# EAGLE design valve (EAGLE 9.6.2)
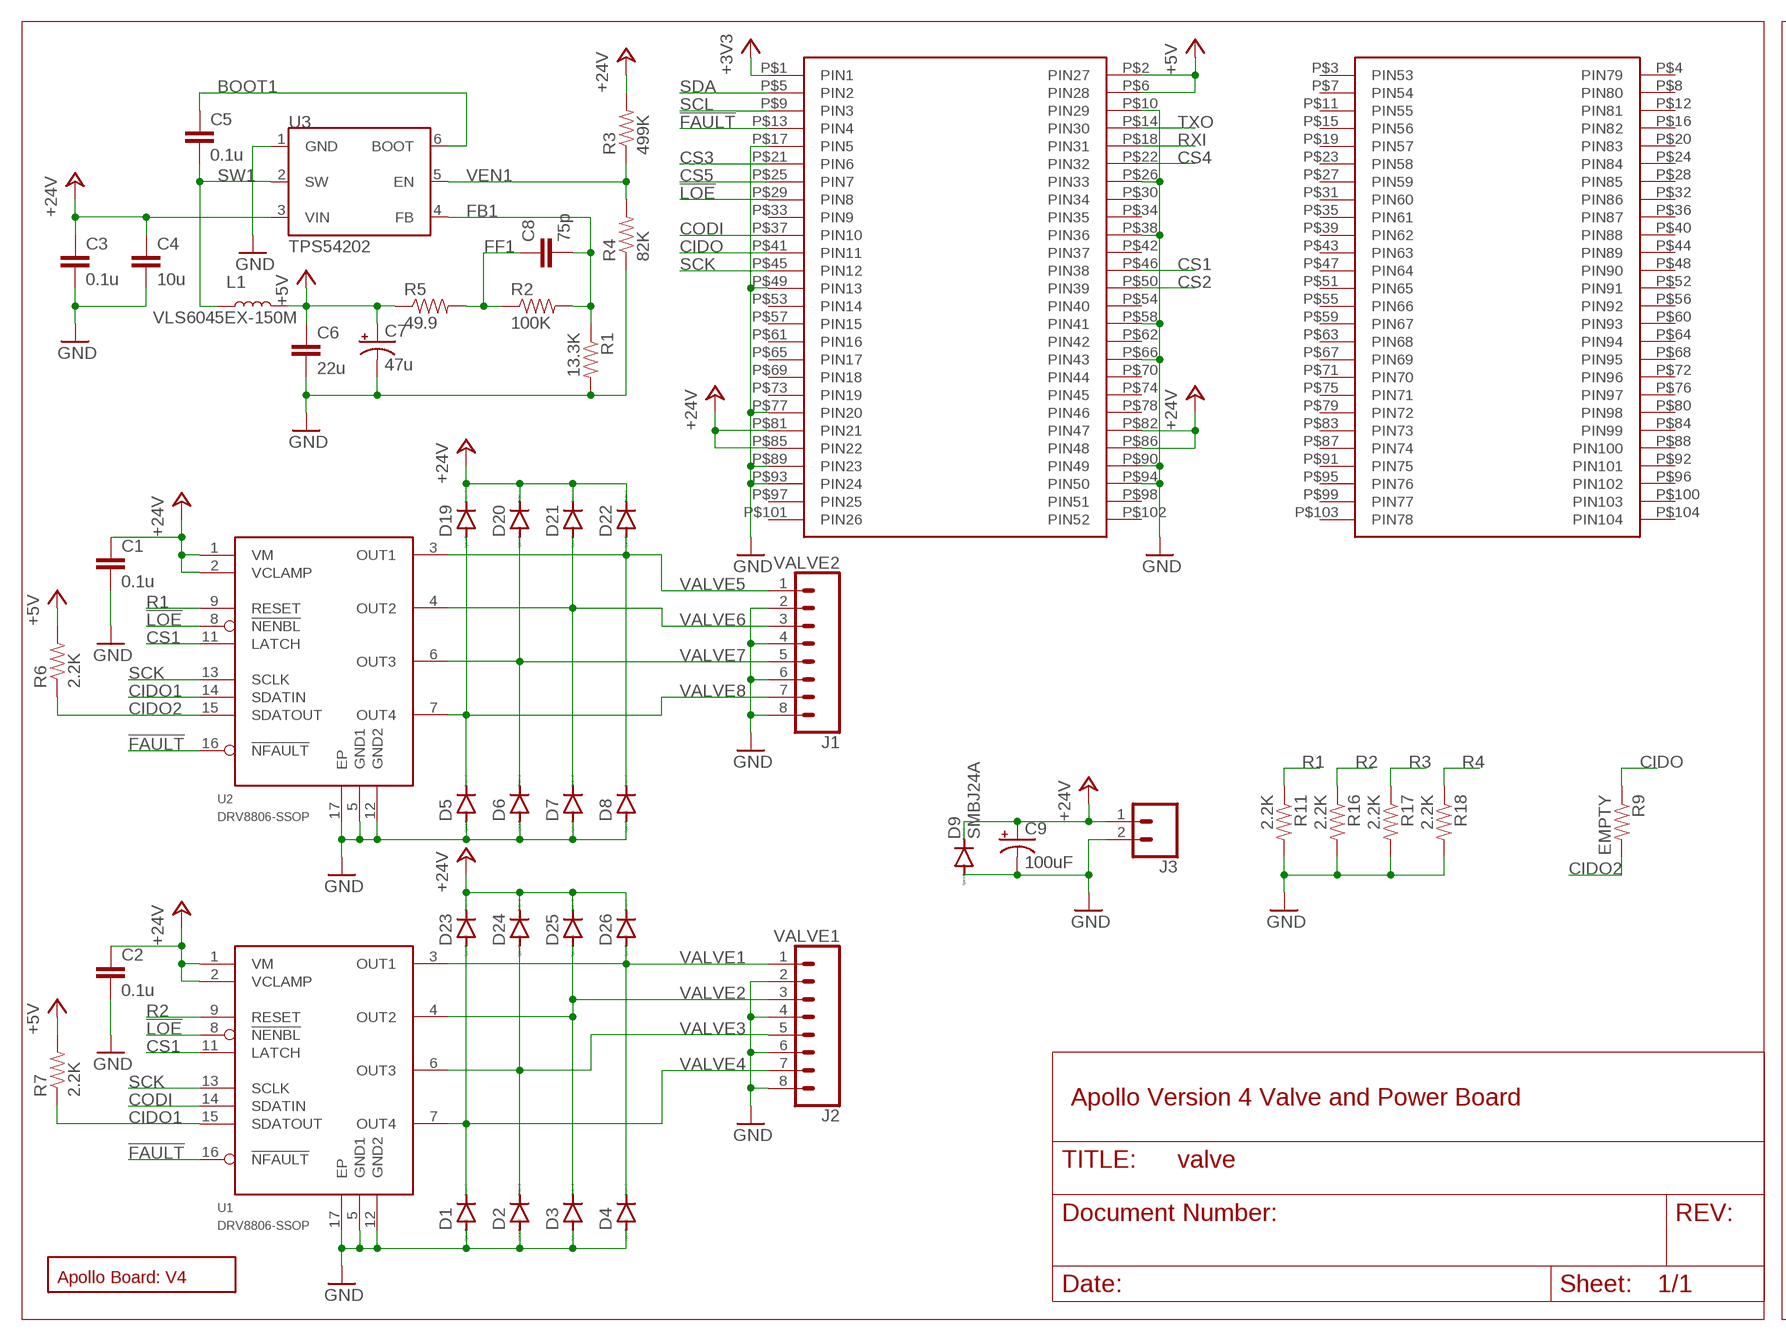
[diagram p0: schematic, sheet 1, part 1 of 2]
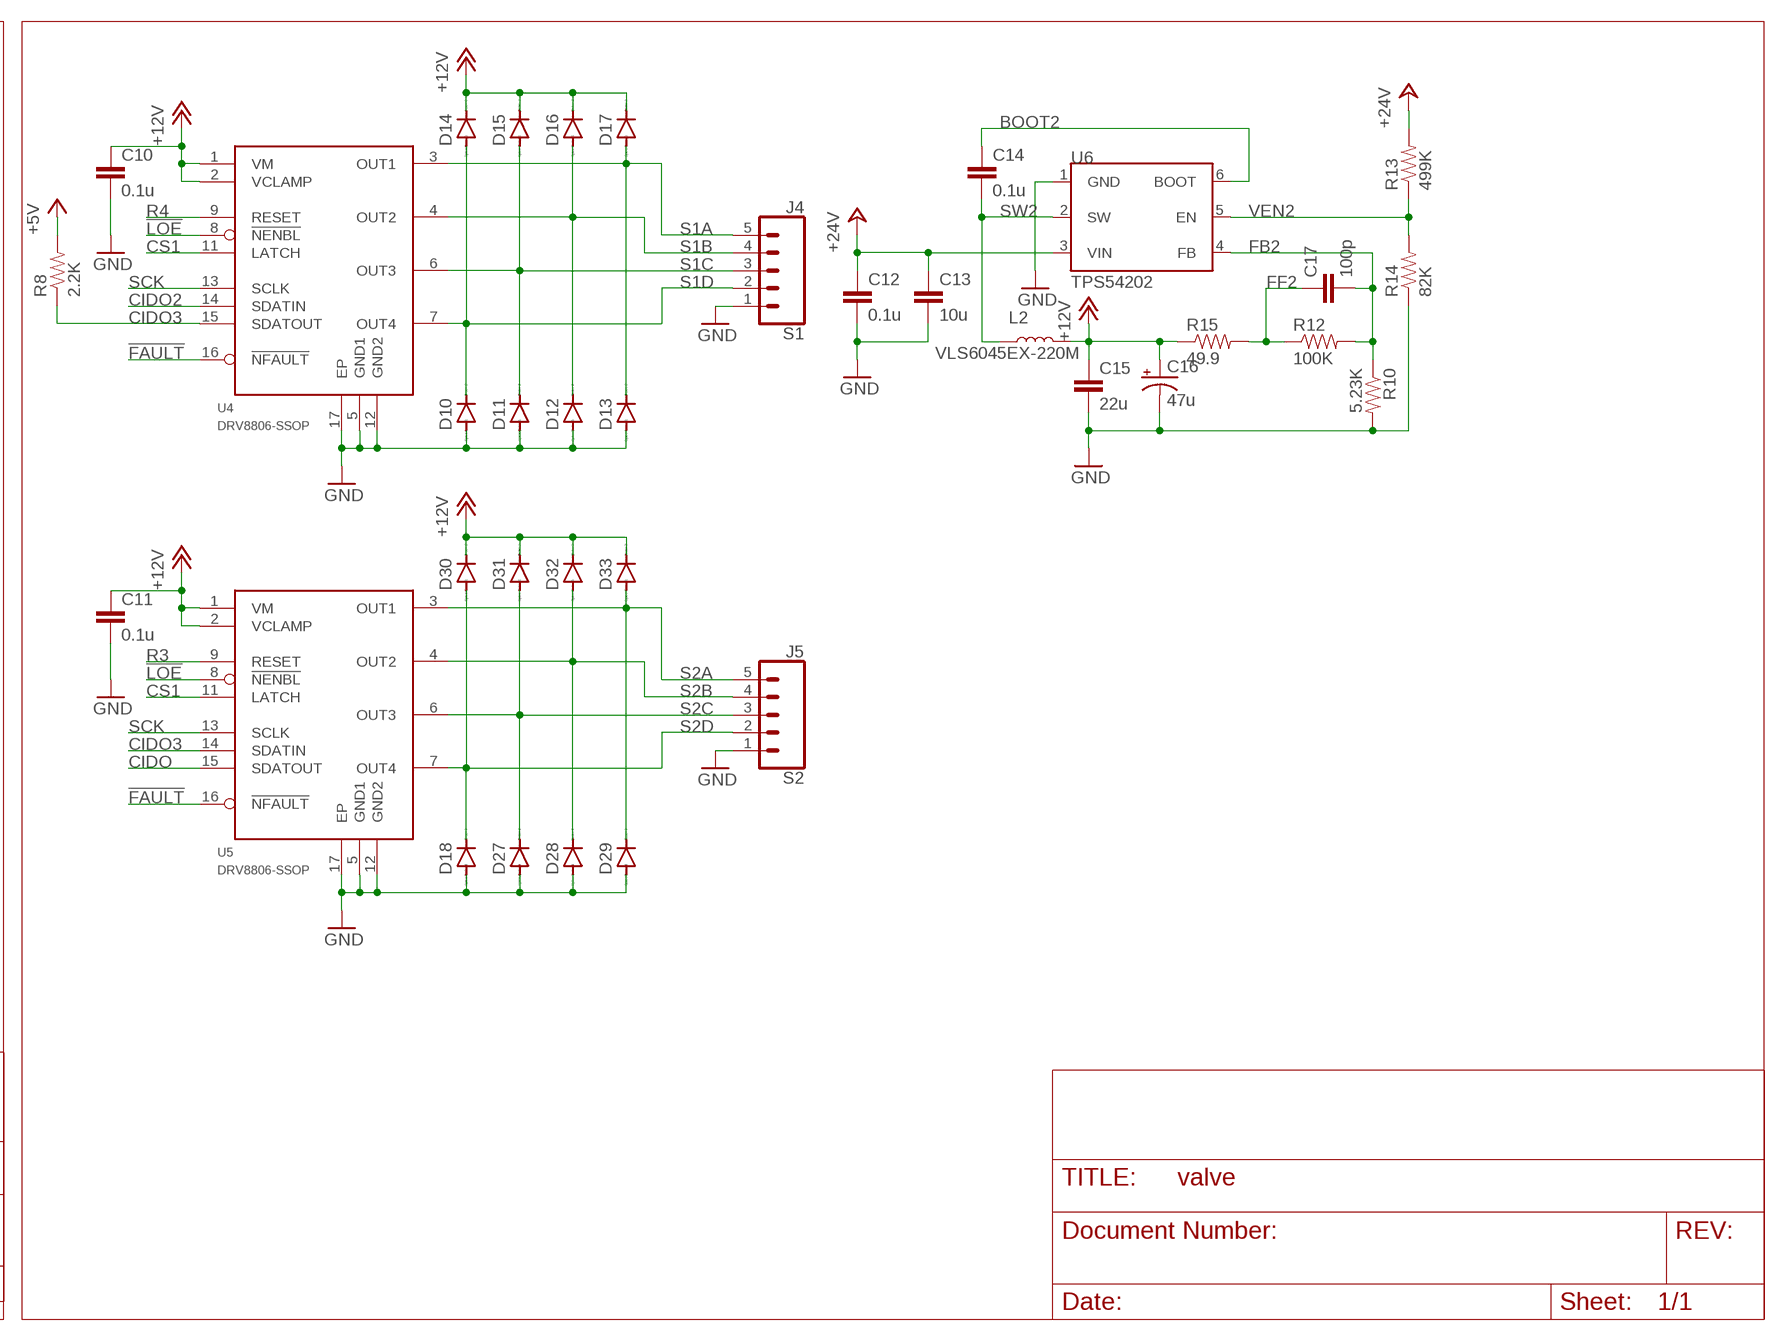
[diagram p1: schematic, sheet 1, part 2 of 2]

## Parts
C1  0.1u  CAP0805  [0805]
C2  0.1u  CAP0805  [0805]
C3  0.1u  CAP0805  [0805]
C4  10u  CAP0805  [0805]
C5  0.1u  CAP0805  [0805]
C6  22u  CAP0805  [0805]
C7  47u  CAP_POLC  [PANASONIC_C]
C8  75p  CAP0805  [0805]
C9  100uF  100UF-POLAR-25V-20%(ELEC)  [PANASONIC_D]
C10  0.1u  CAP0805  [0805]
C11  0.1u  CAP0805  [0805]
C12  0.1u  CAP0805  [0805]
C13  10u  CAP0805  [0805]
C14  0.1u  CAP0805  [0805]
C15  22u  CAP0805  [0805]
C16  47u  CAP_POLC  [PANASONIC_C]
C17  100p  CAP0805  [0805]
D1  B5819W  DIODE-SOD123  [SOD123]
D2  B5819W  DIODE-SOD123  [SOD123]
D3  B5819W  DIODE-SOD123  [SOD123]
D4  B5819W  DIODE-SOD123  [SOD123]
D5  B5819W  DIODE-SOD123  [SOD123]
D6  B5819W  DIODE-SOD123  [SOD123]
D7  B5819W  DIODE-SOD123  [SOD123]
D8  B5819W  DIODE-SOD123  [SOD123]
D9  SMBJ24A  DIODE-SMB  [SMB]
D10  B5819W  DIODE-SOD123  [SOD123]
D11  B5819W  DIODE-SOD123  [SOD123]
D12  B5819W  DIODE-SOD123  [SOD123]
D13  B5819W  DIODE-SOD123  [SOD123]
D14  B5819W  DIODE-SOD123  [SOD123]
D15  B5819W  DIODE-SOD123  [SOD123]
D16  B5819W  DIODE-SOD123  [SOD123]
D17  B5819W  DIODE-SOD123  [SOD123]
D18  B5819W  DIODE-SOD123  [SOD123]
D19  B5819W  DIODE-SOD123  [SOD123]
D20  B5819W  DIODE-SOD123  [SOD123]
D21  B5819W  DIODE-SOD123  [SOD123]
D22  B5819W  DIODE-SOD123  [SOD123]
D23  B5819W  DIODE-SOD123  [SOD123]
D24  B5819W  DIODE-SOD123  [SOD123]
D25  B5819W  DIODE-SOD123  [SOD123]
D26  B5819W  DIODE-SOD123  [SOD123]
D27  B5819W  DIODE-SOD123  [SOD123]
D28  B5819W  DIODE-SOD123  [SOD123]
D29  B5819W  DIODE-SOD123  [SOD123]
D30  B5819W  DIODE-SOD123  [SOD123]
D31  B5819W  DIODE-SOD123  [SOD123]
D32  B5819W  DIODE-SOD123  [SOD123]
D33  B5819W  DIODE-SOD123  [SOD123]
J1  VALVE2  CONN_083.5MM-8  [SCREWTERMINAL-3.5MM-8]
J2  VALVE1  CONN_083.5MM-8  [SCREWTERMINAL-3.5MM-8]
J3  CONN_023.5MM  [SCREWTERMINAL-3.5MM-2]
J4  S1  CONN_05JST  [JST-5-PTH]
J5  S2  CONN_05JST  [JST-5-PTH]
L1  VLS6045EX-150M  VLS6045EX-H  [VLS6045EX]
L2  VLS6045EX-220M  VLS6045EX-H  [VLS6045EX]
R1  13.3K  RESISTOR0805-RES  [0805]
R2  100K  RESISTOR0805-RES  [0805]
R3  499K  RESISTOR0805-RES  [0805]
R4  82K  RESISTOR0805-RES  [0805]
R5  49.9  RESISTOR0805-RES  [0805]
R6  2.2K  RESISTOR0805-RES  [0805]
R7  2.2K  RESISTOR0805-RES  [0805]
R8  2.2K  RESISTOR0805-RES  [0805]
R9  EMPTY  RESISTOR0805-RES  [0805]
R10  5.23K  RESISTOR0805-RES  [0805]
R11  2.2K  RESISTOR0805-RES  [0805]
R12  100K  RESISTOR0805-RES  [0805]
R13  499K  RESISTOR0805-RES  [0805]
R14  82K  RESISTOR0805-RES  [0805]
R15  49.9  RESISTOR0805-RES  [0805]
R16  2.2K  RESISTOR0805-RES  [0805]
R17  2.2K  RESISTOR0805-RES  [0805]
R18  2.2K  RESISTOR0805-RES  [0805]
U1  DRV8806-SSOP  [SOP65P640X120-17N]
U2  DRV8806-SSOP  [SOP65P640X120-17N]
U3  TPS54202  [SOT23-6L]
U4  DRV8806-SSOP  [SOP65P640X120-17N]
U5  DRV8806-SSOP  [SOP65P640X120-17N]
U6  TPS54202  [SOT23-6L]
U$1  PC104_CONNECTOR  [PC104_CONNECTOR]
U$2  BOARD_TEMPLATE1  [BOARD_TEMPLATE]

## Nets
!FAULT!: U1.16(!NFAULT) U2.16(!NFAULT) U4.16(!NFAULT) U5.16(!NFAULT) U$1.P$13(PIN4)
!LOE!: U1.8(!NENBL) U2.8(!NENBL) U4.8(!NENBL) U5.8(!NENBL) U$1.P$29(PIN8)
+3V3: U$1.P$1(PIN1)
+5V: C6.1 C7.+ L1.2 R5.1 R6.2 R7.2 R8.2 U$1.P$2(PIN27) U$1.P$6(PIN28)
+12V: C10.1 C11.1 C15.1 C16.+ D14.C D15.C D16.C D17.C D30.C D31.C D32.C D33.C L2.2 R15.1 U4.1(VM) U4.2(VCLAMP) U5.1(VM) U5.2(VCLAMP)
+24V: C1.1 C2.1 C3.1 C4.1 C9.+ C12.1 C13.1 D9.C D19.C D20.C D21.C D22.C D23.C D24.C D25.C D26.C J3.1 R3.2 R13.2 U1.1(VM) U1.2(VCLAMP) U2.1(VM) U2.2(VCLAMP) U3.3(VIN) U6.3(VIN) U$1.P$81(PIN21) U$1.P$82(PIN47) U$1.P$85(PIN22) U$1.P$86(PIN48)
BOOT1: C5.1 U3.6(BOOT)
BOOT2: C14.1 U6.6(BOOT)
CIDO: R9.1 U5.15(SDATOUT) U$1.P$41(PIN11)
CIDO1: R7.1 U1.15(SDATOUT) U2.14(SDATIN)
CIDO2: R6.1 R9.2 U2.15(SDATOUT) U4.14(SDATIN)
CIDO3: R8.1 U4.15(SDATOUT) U5.14(SDATIN)
CODI: U1.14(SDATIN) U$1.P$37(PIN10)
CS1: U1.11(LATCH) U2.11(LATCH) U4.11(LATCH) U5.11(LATCH) U$1.P$46(PIN38)
CS2: U$1.P$50(PIN39)
CS3: U$1.P$21(PIN6)
CS4: U$1.P$22(PIN32)
CS5: U$1.P$25(PIN7)
FB1: C8.2 R1.1 R2.2 U3.4(FB)
FB2: C17.2 R10.1 R12.2 U6.4(FB)
FF1: C8.1 R2.1 R5.2
FF2: C17.1 R12.1 R15.2
GND: C1.2 C2.2 C3.2 C4.2 C6.2 C7.- C9.- C10.2 C11.2 C12.2 C13.2 C15.2 C16.- D1.A D2.A D3.A D4.A D5.A D6.A D7.A D8.A D9.A D10.A D11.A D12.A D13.A D18.A D27.A D28.A D29.A J1.2 J1.4 J1.6 J1.8 J2.2 J2.4 J2.6 J2.8 J3.2 J4.1 J5.1 R1.2 R4.1 R10.2 R11.2 R14.1 R16.2 R17.2 R18.2 U1.5(GND1) U1.12(GND2) U1.17(EP) U2.5(GND1) U2.12(GND2) U2.17(EP) U3.1(GND) U4.5(GND1) U4.12(GND2) U4.17(EP) U5.5(GND1) U5.12(GND2) U5.17(EP) U6.1(GND) U$1.P$10(PIN29) U$1.P$17(PIN5) U$1.P$26(PIN33) U$1.P$38(PIN36) U$1.P$49(PIN13) U$1.P$58(PIN41) U$1.P$66(PIN43) U$1.P$77(PIN20) U$1.P$89(PIN23) U$1.P$90(PIN49) U$1.P$93(PIN24) U$1.P$94(PIN50)
R1: R11.1 U2.9(RESET)
R2: R16.1 U1.9(RESET)
R3: R17.1 U5.9(RESET)
R4: R18.1 U4.9(RESET)
RXI: U$1.P$18(PIN31)
S1A: D13.C D17.A J4.5 U4.3(OUT1)
S1B: D12.C D16.A J4.4 U4.4(OUT2)
S1C: D11.C D15.A J4.3 U4.6(OUT3)
S1D: D10.C D14.A J4.2 U4.7(OUT4)
S2A: D29.C D33.A J5.5 U5.3(OUT1)
S2B: D28.C D32.A J5.4 U5.4(OUT2)
S2C: D27.C D31.A J5.3 U5.6(OUT3)
S2D: D18.C D30.A J5.2 U5.7(OUT4)
SCK: U1.13(SCLK) U2.13(SCLK) U4.13(SCLK) U5.13(SCLK) U$1.P$45(PIN12)
SCL: U$1.P$9(PIN3)
SDA: U$1.P$5(PIN2)
SW1: C5.2 L1.1 U3.2(SW)
SW2: C14.2 L2.1 U6.2(SW)
TXO: U$1.P$14(PIN30)
VALVE1: D4.C D26.A J2.1 U1.3(OUT1)
VALVE2: D3.C D25.A J2.3 U1.4(OUT2)
VALVE3: D2.C D24.A J2.5 U1.6(OUT3)
VALVE4: D1.C D23.A J2.7 U1.7(OUT4)
VALVE5: D8.C D22.A J1.1 U2.3(OUT1)
VALVE6: D7.C D21.A J1.3 U2.4(OUT2)
VALVE7: D6.C D20.A J1.5 U2.6(OUT3)
VALVE8: D5.C D19.A J1.7 U2.7(OUT4)
VEN1: R3.1 R4.2 U3.5(EN)
VEN2: R13.1 R14.2 U6.5(EN)
Unconnected: U$1.P$3(PIN53) U$1.P$4(PIN79) U$1.P$7(PIN54) U$1.P$8(PIN80) U$1.P$11(PIN55) U$1.P$12(PIN81) U$1.P$15(PIN56) U$1.P$16(PIN82) U$1.P$19(PIN57) U$1.P$20(PIN83) U$1.P$23(PIN58) U$1.P$24(PIN84) U$1.P$27(PIN59) U$1.P$28(PIN85) U$1.P$30(PIN34) U$1.P$31(PIN60) U$1.P$32(PIN86) U$1.P$33(PIN9) U$1.P$34(PIN35) U$1.P$35(PIN61) U$1.P$36(PIN87) U$1.P$39(PIN62) U$1.P$40(PIN88) U$1.P$42(PIN37) U$1.P$43(PIN63) U$1.P$44(PIN89) U$1.P$47(PIN64) U$1.P$48(PIN90) U$1.P$51(PIN65) U$1.P$52(PIN91) U$1.P$53(PIN14) U$1.P$54(PIN40) U$1.P$55(PIN66) U$1.P$56(PIN92) U$1.P$57(PIN15) U$1.P$59(PIN67) U$1.P$60(PIN93) U$1.P$61(PIN16) U$1.P$62(PIN42) U$1.P$63(PIN68) U$1.P$64(PIN94) U$1.P$65(PIN17) U$1.P$67(PIN69) U$1.P$68(PIN95) U$1.P$69(PIN18) U$1.P$70(PIN44) U$1.P$71(PIN70) U$1.P$72(PIN96) U$1.P$73(PIN19) U$1.P$74(PIN45) U$1.P$75(PIN71) U$1.P$76(PIN97) U$1.P$78(PIN46) U$1.P$79(PIN72) U$1.P$80(PIN98) U$1.P$83(PIN73) U$1.P$84(PIN99) U$1.P$87(PIN74) U$1.P$88(PIN100) U$1.P$91(PIN75) U$1.P$92(PIN101) U$1.P$95(PIN76) U$1.P$96(PIN102) U$1.P$97(PIN25) U$1.P$98(PIN51) U$1.P$99(PIN77) U$1.P$100(PIN103) U$1.P$101(PIN26) U$1.P$102(PIN52) U$1.P$103(PIN78) U$1.P$104(PIN104)

## Notes on the sheet
- Apollo Version 4 Valve and Power Board

## Library data of the parts
C1-C6 C8 C10-C15 C17 = apollo-ctrl-v4:CAP: Capacitor Standard 0603 ceramic capacitor, and 0.1" leaded capacitor.
C7 C16 = apollo-ctrl-v4:CAP_POL: Capacitor Polarized These are standard SMD and PTH capacitors. Normally 10uF, 47uF, and 100uF in electrolytic and tantalum varieties. Always verify the external diameter of the through hole cap, it varies with capacity, voltage, and manufacturer. The EIA devices should be standard.
C9 = SparkFun-Capacitors:100UF-POLAR: 100µF polarized capacitors A capacitor is a passive two-terminal electrical component used to store electrical energy temporarily in an electric field.; PROD_ID: CAP-12547
D1-D33 = diode:DIODE-: DIODE
J1 J2 = SparkFun-Connectors:CONN_08: Multi connection point. Often used as Generic Header-pin footprint for 0.1 inch spaced/style header connections On any of the 0.1 inch spaced packages, you can populate with these: Break Away Headers - Straight <https://www.sparkfun.com/products/116> (PRT-00116) Break Away Male Headers - Right Angle <https://www.sparkfun.com/products/553> (PRT-00553) Female Headers <https://www.sparkfun.com/products/115> (PRT-00115) Break Away Headers - Machine Pin <https://www.sparkfun.com/products/117> (PRT-00117) Break Away Female Headers - Swiss Machine Pin <https://www.sparkfun.com/products/743> (PRT-00743) Arduino Stackable Header - 8 Pin <https://www.sparkfun.com/products/9279> (PRT-09279) For SCREWTERMINALS and SPRING TERMINALS visit here: Screw Terimnals on SparkFun.com <https://www.sparkfun.com/search/results?term=Screw+Terminals> (5mm/3.5mm/2.54mm spacing) This device is also useful as a general connection point to wire up your design to another part of your project. Our various solder wires solder well into these plated through hole pads. Hook-Up Wire - Assortment (Stranded, 22 AWG) <https://www.sparkfun.com/products/11375> (PRT-11375) Hook-Up Wire - Assortment (Solid Core, 22 AWG) <https://www.sparkfun.com/products/11367> (PRT-11367) View the entire wire category on our website here <https://www.sparkfun.com/categories/141> Special notes: Molex polarized connector foot print use with SKU : PRT-08231 with associated crimp pins and housings. 1MM SMD Version SKU: PRT-10208 NOTES ON THE VARIANTS LOCK and LOCK_LONGPADS... This footprint was designed to help hold the alignment of a through-hole component (i.e. 6-pin header) while soldering it into place. You may notice that each hole has been shifted either up or down by 0.005 of an inch from it's more standard position (which is a perfectly straight line). This slight alteration caused the pins (the squares in the middle) to touch the edges of the holes. Because they are alternating, it causes a "brace" to hold the component in place. 0.005 has proven to be the perfect amount of "off-center" position when using our standard breakaway headers. Although looks a little odd when you look at the bare footprint, once you have a header in there, the alteration is very hard to notice. Also,if you push a header all the way into place, it is covered up entirely on the bottom side.
J3 = SparkFun-Connectors:CONN_02: Multi connection point. Often used as Generic Header-pin footprint for 0.1 inch spaced/style header connections On any of the 0.1 inch spaced packages, you can populate with these: Break Away Headers - Straight <https://www.sparkfun.com/products/116> (PRT-00116) Break Away Male Headers - Right Angle <https://www.sparkfun.com/products/553> (PRT-00553) Female Headers <https://www.sparkfun.com/products/115> (PRT-00115) Break Away Headers - Machine Pin <https://www.sparkfun.com/products/117> (PRT-00117) Break Away Female Headers - Swiss Machine Pin <https://www.sparkfun.com/products/743> (PRT-00743) For SCREWTERMINALS and SPRING TERMINALS visit here: Screw Terimnals on SparkFun.com <https://www.sparkfun.com/search/results?term=Screw+Terminals> (5mm/3.5mm/2.54mm spacing) This device is also useful as a general connection point to wire up your design to another part of your project. Our various solder wires solder well into these plated through hole pads. Hook-Up Wire - Assortment (Stranded, 22 AWG) <https://www.sparkfun.com/products/11375> (PRT-11375) Hook-Up Wire - Assortment (Solid Core, 22 AWG) <https://www.sparkfun.com/products/11367> (PRT-11367) View the entire wire category on our website here <https://www.sparkfun.com/categories/141> Special notes: Molex polarized connector foot print use with: PRT-08233 with associated crimp pins and housings. 2.54_SCREWTERM for use with PRT-10571. 3.5mm Screw Terminal footprints for PRT-08084 5mm Screw Terminal footprints for use with PRT-08432; PROD_ID: CONN-08399
J4 J5 = SparkFun-Connectors:CONN_05: Multi connection point. Often used as Generic Header-pin footprint for 0.1 inch spaced/style header connections On any of the 0.1 inch spaced packages, you can populate with these: Break Away Headers - Straight <https://www.sparkfun.com/products/116> (PRT-00116) Break Away Male Headers - Right Angle <https://www.sparkfun.com/products/553> (PRT-00553) Female Headers <https://www.sparkfun.com/products/115> (PRT-00115) Break Away Headers - Machine Pin <https://www.sparkfun.com/products/117> (PRT-00117) Break Away Female Headers - Swiss Machine Pin <https://www.sparkfun.com/products/743> (PRT-00743) For SCREWTERMINALS and SPRING TERMINALS visit here: Screw Terimnals on SparkFun.com <https://www.sparkfun.com/search/results?term=Screw+Terminals> (5mm/3.5mm/2.54mm spacing) This device is also useful as a general connection point to wire up your design to another part of your project. Our various solder wires solder well into these plated through hole pads. Hook-Up Wire - Assortment (Stranded, 22 AWG) <https://www.sparkfun.com/products/11375> (PRT-11375) Hook-Up Wire - Assortment (Solid Core, 22 AWG) <https://www.sparkfun.com/products/11367> (PRT-11367) View the entire wire category on our website here <https://www.sparkfun.com/categories/141> Special notes: Molex polarized connector foot print use with SKU : PRT-08231 with associated crimp pins and housings. 1MM SMD Version SKU: PRT-10208; SF_ID: PRT-09917
L1 L2 = apollo-ctrl-v4:VLS6045EX-H: VLS6045EX-H Inductors for power circuits
R1-R18 = apollo-ctrl-v4:RESISTOR: Resistor Basic schematic elements and footprints for 0603, 1206, and PTH resistors.
U1 U2 U4 U5 = apollo-ctrl-v4:DRV8806
U3 U6 = apollo-ctrl-v4:TPS54202: TPS54202H 4.5-V to 28-V Input, 2-A Output, SWIFT™ Synchronous Step Down Voltage Converter
U$1 = template_board:PC104_CONNECTOR
U$2 = template_board:BOARD_TEMPLATE

## Board
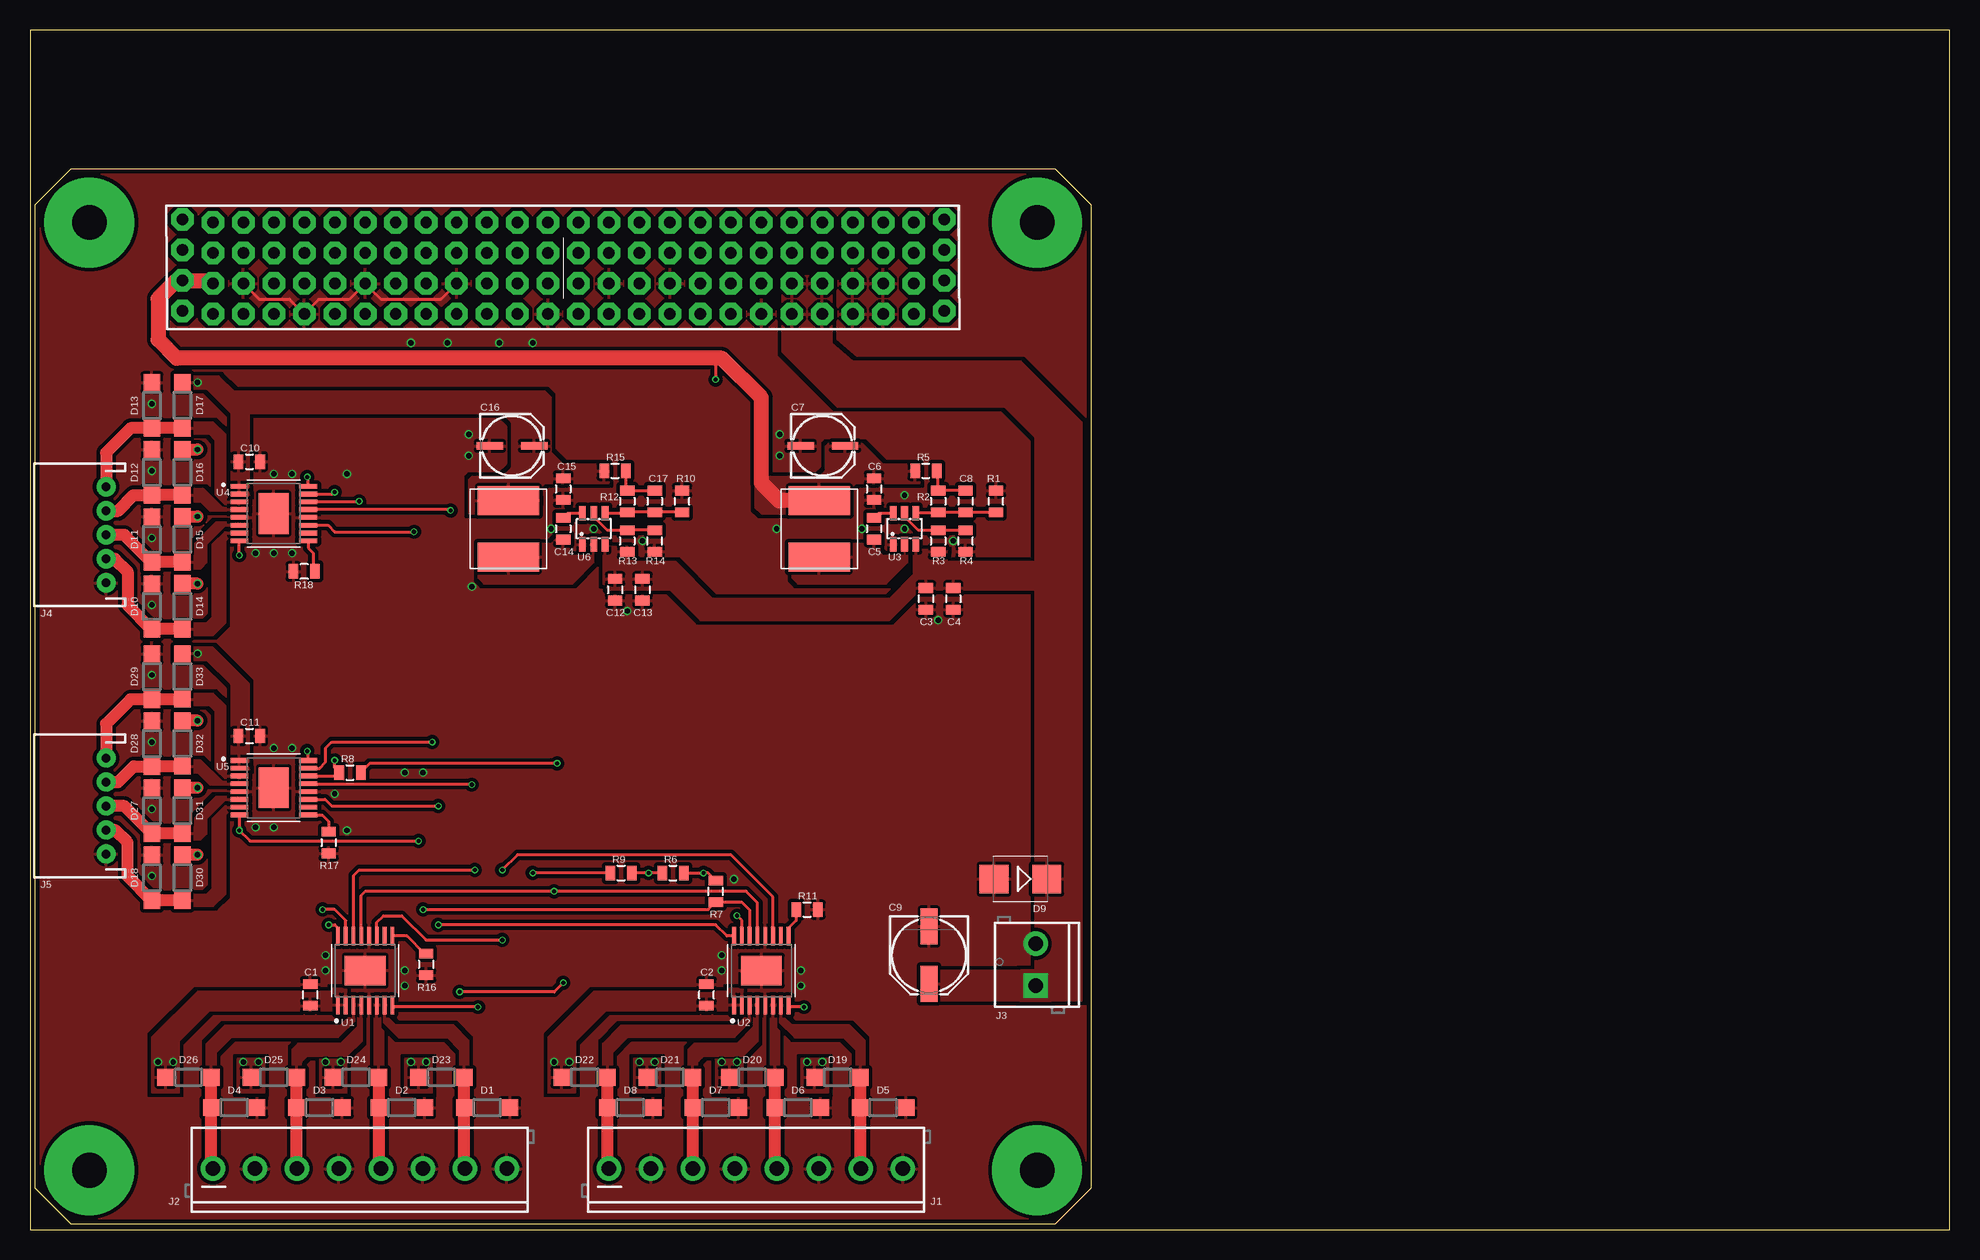
[diagram p2: board, top side]
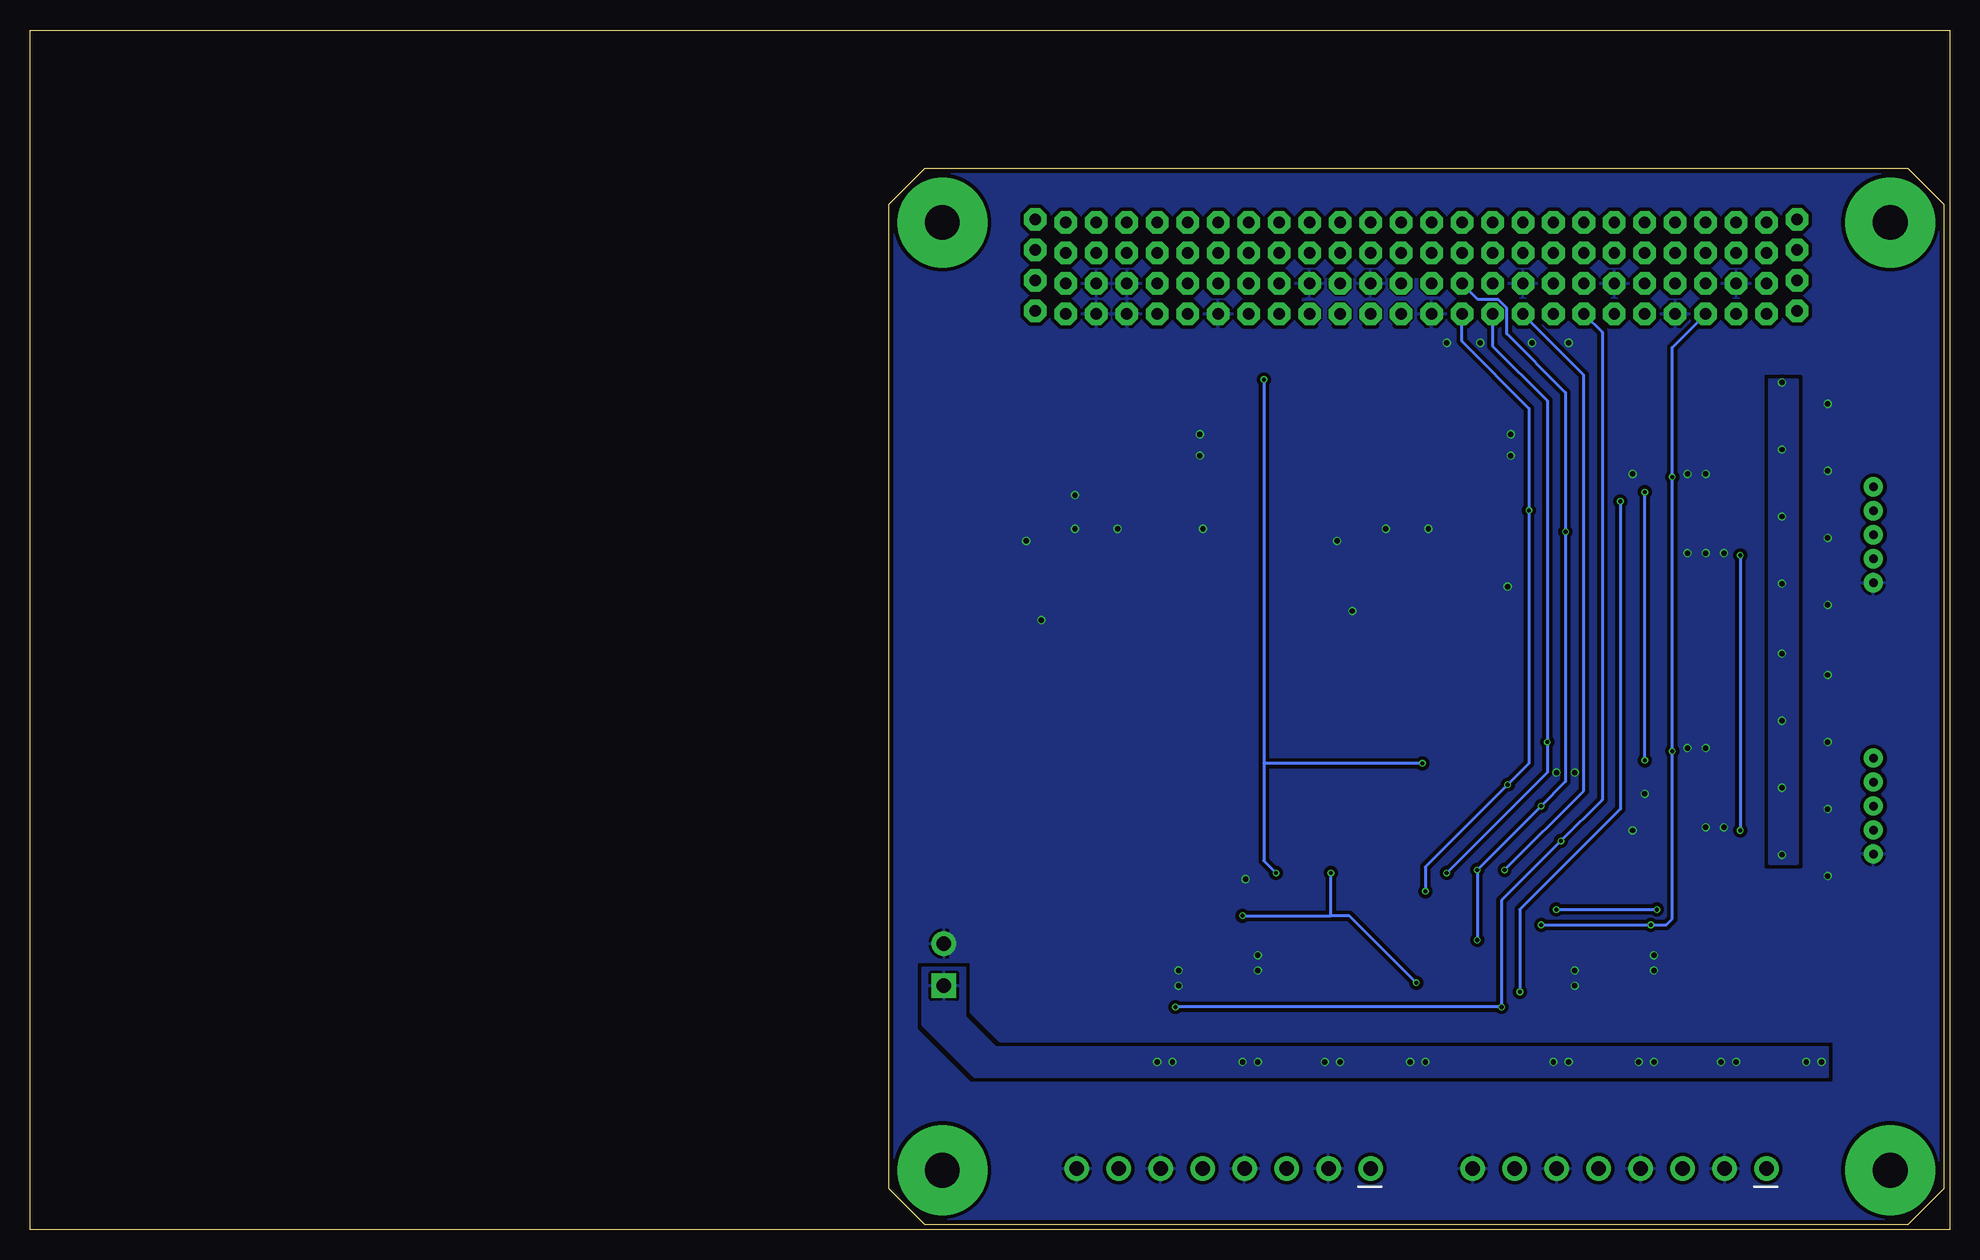
[diagram p3: board, bottom side, seen from below]

Size 160 x 100 mm. Coordinates in mm from the lower left corner, seen from the top.
Outline: 0,0 160,0 160,100 0,100 0,0
Copper layers (1*2*15*16): Top 0.035559375mm / dielectric 0.17018125mm / Route2 0.01778125mm / dielectric 47mil / Route15 0.01778125mm / dielectric 0.17018125mm / Bottom 0.035559375mm
Design rules "oshpark-4layer *": minimum track width 5mil, minimum drill 10mil, track to track 5mil, track to pad 5mil, pad to pad 5mil, via to via 5mil, smd to smd 5mil, copper to edge 15mil, drill to drill 6mil, minimum pad ring 4mil, minimum via ring 4mil, stop-mask expansion 1.5mil, vias tented up to drill 0mil, thermal gap 10mil

### Footprints (pad centres in the part's own frame; a part is rotated, then mirrored left to right if it is on the bottom)
0805 = smd 0.8 x 1.2: 1 -0.9,0; 2 0.9,0
PANASONIC_C = smd 2.2 x 0.65: + 1.9,-0.2; - -1.8,-0.2
PANASONIC_D = smd 3 x 1.4: + 2.4,0; - -2.4,0
SOD123 = smd 1.4 x 1.4: A 1.9,0; C -1.9,0
SMB = smd 2.4 x 2.4: A 2.2,0; C -2.2,0
SCREWTERMINAL-3.5MM-8 = drill 1.2 pad 2.032: 1 0,0; 2 3.5,0; 3 7,0; 4 10.5,0; 5 14,0; 6 17.5,0; 7 21,0; 8 24.5,0
SCREWTERMINAL-3.5MM-2 = drill 1.2 pad 2.032 square: 1 0,0 | drill 1.2 pad 2.032: 2 3.5,0
JST-5-PTH = drill 0.7 pad 1.6: 1 -4,0; 2 -2,0; 3 0,0; 4 2,0; 5 4,0
VLS6045EX = smd 2.4 x 5.1: 1 -2.35,0; 2 2.35,0
SOP65P640X120-17N = smd 1.57 x 0.41: 1 -2.87,2.275; 2 -2.87,1.625; 3 -2.87,0.975; 4 -2.87,0.325; 5 -2.87,-0.325; 6 -2.87,-0.975; 7 -2.87,-1.625; 8 -2.87,-2.275; 9 2.87,-2.275; 10 2.87,-1.625; 11 2.87,-0.975; 12 2.87,-0.325; 13 2.87,0.325; 14 2.87,0.975; 15 2.87,1.625; 16 2.87,2.275 | smd 2.48 x 3.4: 17 0,0
SOT23-6L = smd 0.55 x 1.2: 1 -0.95,-1.3; 2 0,-1.3; 3 0.95,-1.3; 4 0.95,1.3; 5 0,1.3; 6 -0.95,1.3
PC104_CONNECTOR = drill 0.953 pad 1.88 octagon: P$1 -31.75,32.134; P$2 -31.75,34.674; P$3 -31.75,37.214; P$4 -31.75,39.754; P$5 -29.21,31.88; P$6 -29.21,34.42; P$7 -29.21,36.96; P$8 -29.21,39.5; P$9 -26.67,31.88; P$10 -26.67,34.42; P$11 -26.67,36.96; P$12 -26.67,39.5; P$13 -24.13,31.88; P$14 -24.13,34.42; P$15 -24.13,36.96; P$16 -24.13,39.5; P$17 -21.59,31.88; P$18 -21.59,34.42; P$19 -21.59,36.96; P$20 -21.59,39.5; P$21 -19.05,31.88; P$22 -19.05,34.42; P$23 -19.05,36.96; P$24 -19.05,39.5; P$25 -16.51,31.88; P$26 -16.51,34.42; P$27 -16.51,36.96; P$28 -16.51,39.5; P$29 -13.97,31.88; P$30 -13.97,34.42; P$31 -13.97,36.96; P$32 -13.97,39.5; P$33 -11.43,31.88; P$34 -11.43,34.42; P$35 -11.43,36.96; P$36 -11.43,39.5; P$37 -8.89,31.88; P$38 -8.89,34.42; P$39 -8.89,36.96; P$40 -8.89,39.5; P$41 -6.35,31.88; P$42 -6.35,34.42; P$43 -6.35,36.96; P$44 -6.35,39.5; P$45 -3.81,31.88; P$46 -3.81,34.42; P$47 -3.81,36.96; P$48 -3.81,39.5; P$49 -1.27,31.88; P$50 -1.27,34.42; P$51 -1.27,36.96; P$52 -1.27,39.5; P$53 1.27,31.88; P$54 1.27,34.42; P$55 1.27,36.96; P$56 1.27,39.5; P$57 3.81,31.88; P$58 3.81,34.42; P$59 3.81,36.96; P$60 3.81,39.5; P$61 6.35,31.88; P$62 6.35,34.42; P$63 6.35,36.96; P$64 6.35,39.5; P$65 8.89,31.88; P$66 8.89,34.42; P$67 8.89,36.96; P$68 8.89,39.5; P$69 11.43,31.88; P$70 11.43,34.42; P$71 11.43,36.96; P$72 11.43,39.5; P$73 13.97,31.88; P$74 13.97,34.42; P$75 13.97,36.96; P$76 13.97,39.5; P$77 16.51,31.88; P$78 16.51,34.42; P$79 16.51,36.96; P$80 16.51,39.5; P$81 19.05,31.88; P$82 19.05,34.42; P$83 19.05,36.96; P$84 19.05,39.5; P$85 21.59,31.88; P$86 21.59,34.42; P$87 21.59,36.96; P$88 21.59,39.5; P$89 24.13,31.88; P$90 24.13,34.42; P$91 24.13,36.96; P$92 24.13,39.5; P$93 26.67,31.88; P$94 26.67,34.42; P$95 26.67,36.96; P$96 26.67,39.5; P$97 29.21,31.88; P$98 29.21,34.42; P$99 29.21,36.96; P$100 29.21,39.5; P$101 31.75,32.134; P$102 31.75,34.674; P$103 31.75,37.214; P$104 31.75,39.754
BOARD_TEMPLATE = drill 2.9 pad 7.5: P$1 -39.5,39.5; P$2 -39.5,-39.5; P$3 39.5,-39.5; P$4 39.5,39.5

### Placement (x,y rotation side)
C1  23.37,19.56 90 top
C2  56.39,19.56 90 top
C3  74.68,52.58 270 top
C4  76.96,52.58 270 top
C5  70.36,58.42 270 top
C6  70.36,61.72 270 top
C7  66.04,65.53 0 top
C8  77.98,60.71 270 top
C9  74.93,22.86 270 top
C10  18.29,64.01 0 top
C11  18.29,41.15 0 top
C12  48.77,53.34 270 top
C13  51.05,53.34 270 top
C14  44.45,58.42 270 top
C15  44.45,61.72 270 top
C16  40.13,65.53 0 top
C17  52.07,60.71 270 top
D1  38.1,10.16 0 top
D2  30.99,10.16 0 top
D3  24.13,10.16 0 top
D4  17.02,10.16 0 top
D5  71.12,10.16 0 top
D6  64.01,10.16 0 top
D7  57.15,10.16 0 top
D8  50.04,10.16 0 top
D9  82.55,29.21 180 top
D10  10.16,51.94 90 top
D11  10.16,57.52 90 top
D12  10.16,63.11 90 top
D13  10.16,68.7 90 top
D14  12.7,51.95 270 top
D15  12.7,57.54 270 top
D16  12.7,63.13 270 top
D17  12.7,68.71 270 top
D18  10.16,29.33 90 top
D19  67.31,12.7 0 top
D20  60.2,12.7 0 top
D21  53.34,12.7 0 top
D22  46.23,12.7 0 top
D23  34.29,12.7 0 top
D24  27.18,12.7 0 top
D25  20.32,12.7 0 top
D26  13.21,12.7 0 top
D27  10.16,34.92 90 top
D28  10.16,40.51 90 top
D29  10.16,46.09 90 top
D30  12.7,29.34 270 top
D31  12.7,34.93 270 top
D32  12.7,40.52 270 top
D33  12.7,46.11 270 top
J1  48.26,5.08 0 top
J2  15.24,5.08 0 top
J3  83.82,20.32 90 top
J4  6.35,57.91 90 top
J5  6.35,35.31 90 top
L1  65.79,58.42 90 top
L2  39.88,58.42 90 top
R1  80.52,60.71 90 top
R2  75.69,60.71 270 top
R3  75.69,57.4 270 top
R4  77.98,57.4 90 top
R5  74.68,63.25 0 top
R6  53.59,29.72 0 top
R7  57.15,28.19 90 top
R8  26.67,38.1 0 top
R9  49.28,29.72 0 top
R10  54.36,60.71 90 top
R11  64.77,26.67 0 top
R12  49.78,60.71 270 top
R13  49.78,57.4 270 top
R14  52.07,57.4 90 top
R15  48.77,63.25 0 top
R16  33.02,22.1 270 top
R17  24.89,32.26 270 top
R18  22.86,54.86 180 top
U1  27.94,21.59 90 top
U2  60.96,21.59 90 top
U3  72.9,58.42 0 top
U4  20.32,59.69 0 top
U5  20.32,36.83 0 top
U6  46.99,58.42 0 top
U$1  44.45,44.45 0 top
U$2  44.45,44.45 0 top

### Tracks (layer width: path | path; a pad name or v marks a point on that pad's centre or on a via)
!FAULT!  (via drill 0.35)
  Top 0.254: v24.89,25.4 25.4,25.4 25.66,25.14 U1.16 | U4.16 23.19,62.66 v23.11,62.74 | U5.16 23.19,39.8 v23.11,39.88 | v34.04,25.4 57.15,25.4 58.09,24.46 U2.16
  Bottom 0.254: v34.04,25.4 v24.89,25.4 23.62,25.4 23.11,25.91 v23.11,39.88 v23.11,62.74 23.11,73.54 U$1.P$13
!LOE!  (via drill 0.35)
  Top 0.254: v64.52,18.54 63.41,18.54 U2.8 | v37.34,18.54 30.39,18.54 U1.8 | v17.45,56.21 U4.8 | v32.38,32.38 18.34,32.38 v17.45,33.27 U5.8
  Bottom 0.254: v64.52,18.54 v37.34,18.54 37.34,27.43 v32.38,32.38 28.96,35.81 28.96,74.81 U$1.P$29 | v17.45,56.21 v17.45,33.27
+5V  (via drill 0.35)
  Top 0.254: 57.15,72.64 v57.15,70.87 | R6.2 v56.13,29.72 56.53,29.72 R7.2 | v43.94,38.86 28.33,38.86 R8.2
  Top 1.27: L1.2 62.42,60.77 60.96,62.23 60.96,69.34 57.66,72.64 57.15,72.64 12.19,72.64 10.67,74.17 10.67,77.6 12.19,79.12 U$1.P$2 14.99,79.12 U$1.P$6
  Bottom 0.254: v57.15,70.87 57.15,38.86 | 57.15,38.86 57.15,30.73 v56.13,29.72 | v43.94,38.86 57.15,38.86
  pour Top (isolate 0.254, rank 2): 60.45,60.2 60.96,59.69 68.07,59.69 68.07,61.47 68.83,62.23 74.17,62.23 74.17,63.75 71.12,63.75 69.34,65.53 66.55,65.53 66.29,65.28 66.29,63.25 65.79,62.74 60.45,62.74
+12V  (via drill 0.45)
  Top 1.016: D33.C | D32.C v13.97,42.42 | D31.C v13.97,36.83 | D30.C v13.97,31.24 | D16.C v13.97,65.03 v13.97,65.02 | D17.C | v13.97,53.85 D14.C | D15.C v13.97,59.44
  other vias: 13.97,48.01 13.97,70.61
  pour Top (isolate 0.254, rank 3): 12.19,48.51 12.19,47.5 14.73,47.5 16.76,45.47 16.76,38.35 18.29,38.35 18.29,45.47 15.24,48.51
  pour Top (isolate 0.254, rank 3): 12.19,71.12 12.19,70.1 14.73,70.1 16.76,68.07 16.76,61.21 18.29,61.21 18.29,68.07 39.37,68.07 40.13,67.31 40.13,63.5 39.37,62.74 36.83,62.74 36.58,62.48 36.58,59.69 42.42,59.69 42.42,61.72 42.93,62.23 48.26,62.23 48.26,63.75 44.45,63.75 43.43,64.77 43.43,69.34 42.93,69.85 17.02,69.85 15.75,71.12
  pour Bottom (isolate 0.305, rank 3): 12.7,70.87 12.7,30.48 14.99,30.48 14.99,70.87
+24V  (via drill 0.45)
  other vias: 11.94,13.97 10.67,13.97 64.77,13.97 66.04,13.97 31.75,13.97 33.02,13.97 24.64,13.97 25.91,13.97 17.78,13.97 19.05,13.97 44.96,13.97 43.69,13.97 57.66,13.97 58.93,13.97 50.8,13.97 52.07,13.97
  pour Bottom (isolate 0.254, rank 3): 10.16,15.24 10.16,12.7 81.28,12.7 85.6,17.02 85.6,21.84 82.04,21.84 82.04,17.78 79.5,15.24
  pour Top (rank 3): 17.27,14.22 17.27,11.43 19.56,11.43 19.56,14.22
  pour Top (rank 3): 24.13,14.22 24.13,11.43 26.42,11.43 26.42,14.22
  pour Top (rank 3): 31.24,14.22 31.24,11.43 33.53,11.43 33.53,14.22
  pour Top (rank 3): 50.29,14.22 50.29,11.43 52.58,11.43 52.58,14.22
  pour Top (rank 3): 64.26,14.22 64.26,11.43 66.55,11.43 66.55,14.22
  pour Top (isolate 0.305, rank 3): 82.55,72.39 87.63,67.31 87.63,19.05 74.42,19.05 74.42,21.59 83.82,21.59 83.82,66.04 81.28,68.58 67.31,68.58 62.74,73.15 62.74,79.5 66.8,79.5 66.8,73.91 68.58,72.39
  pour Top (isolate 0.254, rank 2): 43.18,11.43 45.47,11.43 45.47,15.75 48.01,18.29 59.44,18.29 59.44,20.07 58.17,20.07 58.17,19.81 46.99,19.81 43.18,16
  pour Top (isolate 0.254, rank 2): 10.16,11.43 12.45,11.43 12.45,15.75 14.99,18.29 26.42,18.29 26.42,20.07 25.15,20.07 25.15,19.81 13.97,19.81 10.16,16
  pour Top (isolate 0.254, rank 2, no thermals): 82.55,21.59 82.55,19.05 85.09,19.05 85.09,21.59
  pour Top (rank 3): 57.15,14.22 57.15,11.43 59.44,11.43 59.44,14.22
  pour Top (isolate 0.254, rank 2): 47.75,56.9 47.75,53.85 48.26,53.34 53.34,53.34 55.88,50.8 71.63,50.8 74.17,53.34 84.07,53.34 84.07,55.63 76.45,55.63 76.45,56.64 73.91,56.64 73.91,57.66 73.66,57.66 73.66,54.61 71.63,52.58 56.9,52.58 53.85,55.63 50.55,55.63 50.29,55.88 50.29,56.9
BOOT1
  Top 0.254: C5.1 70.76,59.72 U3.6
BOOT2
  Top 0.254: C14.1 44.85,59.72 U6.6
CIDO  (via drill 0.35)
  Top 0.254: R9.1 v41.91,29.72 | U5.15 24.13,38.45 24.64,38.96 24.64,40.13 25.15,40.64 v33.53,40.64
  Bottom 0.254: U$1.P$41 38.1,73.66 33.53,69.09 v33.53,40.64 33.53,38.1 v41.91,29.72
CIDO1  (via drill 0.35)
  Top 0.254: U2.14 59.98,26.63 59.32,27.29 R7.1 56.53,26.67 v32.77,26.67 | v24.38,26.67 25.4,26.67 26.32,25.75 U1.15
  Bottom 0.254: v32.77,26.67 v24.38,26.67
CIDO2  (via drill 0.35)
  Top 0.254: R6.1 v51.56,29.72 R9.2 | U2.15 59.34,25.75 v58.93,26.16 | v27.43,60.71 27.39,60.66 U4.14 | v44.45,20.57 43.69,19.81 v35.81,19.81
  Bottom 0.254: v58.93,26.16 51.56,26.16 | 51.56,26.16 v51.56,29.72 | v27.43,60.71 27.43,35.05 35.81,26.67 v35.81,19.81 | v44.45,20.57 50.04,26.16 51.56,26.16
CIDO3  (via drill 0.35)
  Top 0.254: U5.14 25.48,37.8 R8.1 25.4,38.47 v25.4,39.12 | v25.4,61.47 25.25,61.31 U4.15
  Bottom 0.254: v25.4,39.12 v25.4,61.47
CODI  (via drill 0.35)
  Top 0.254: U1.14 26.96,29.5 27.43,29.97 v37.08,29.97
  Bottom 0.254: v37.08,29.97 30.48,36.58 30.48,71.25 U$1.P$37
CS1  (via drill 0.35)
  Top 0.254: U2.11 61.94,27.73 58.42,31.24 40.64,31.24 v39.37,29.97 | v39.37,24.13 33.02,24.13 30.99,26.16 29.46,26.16 28.91,25.61 U1.11 | U5.11 24.6,35.85 25.15,35.31 v34.04,35.31 | U4.11 24.85,58.72 25.4,58.17 v32,58.17
  Bottom 0.254: v39.37,24.13 v39.37,29.97 v34.04,35.31 32,37.34 v32,58.17 32,69.78 36.91,74.68 36.91,76.82 37.61,77.52 39.29,77.52 U$1.P$46
FB1
  Top 0.254: R1.1 C8.2 R2.2 75.61,59.72 U3.4
FB2
  Top 0.254: R10.1 C17.2 R12.2 49.7,59.72 U6.4
FF1
  Top 0.254: C8.1 R2.1 75.69,63.13 R5.2
FF2
  Top 0.254: R15.2 49.67,61.72 R12.1 C17.1
GND  (via drill 0.45)
  Top 0.254: U$1.P$10 19.13,77.52 21.67,77.52 U$1.P$17 24.05,77.52 26.59,77.52 U$1.P$26 29.29,77.52 34.21,77.52 U$1.P$38
  other vias: 24.64,22.86 24.64,21.59 31.24,20.32 31.24,21.59 57.66,22.86 57.66,21.59 64.26,20.32 64.26,21.59 72.9,58.42 62.23,58.42 69.34,58.42 72.9,61.21 62.48,66.29 62.48,64.52 76.96,57.4 41.91,73.91 31.75,73.91 34.8,73.91 46.99,58.42 43.43,58.42 36.58,66.29 36.58,64.52 49.78,51.56 75.69,50.8 36.83,53.59 58.67,29.21 25.4,36.32 20.32,33.53 18.8,33.53 20.32,40.13 21.84,40.13 20.32,56.39 21.84,56.39 18.8,56.39 20.32,62.99 21.84,62.99 31.24,38.1 32.77,38.1 10.16,29.46 10.16,35.05 10.16,40.64 10.16,46.23 10.16,52.07 10.16,57.66 10.16,63.25 10.16,68.83 39.12,73.91 26.42,33.27 26.42,62.99 51.05,57.4
  pour Top (isolate 0.305, rank 4): 0,88.9 0,0 88.9,0 88.9,88.9
  pour Bottom (isolate 0.305, rank 4): 0,88.9 0,0 87.63,0 88.9,1.27 88.9,88.9
  pour Bottom (isolate 0.152, rank 3): 42.67,75.44 53.85,75.44 53.85,79.25 42.67,79.25
  pour Top (isolate 0.254, rank 2, no thermals): 83.31,25.4 83.31,22.1 82.55,22.1 82.55,25.4
  pour Bottom (isolate 0.254, rank 2, no thermals): 83.31,25.4 83.31,22.35 82.55,22.35 82.55,25.4
R1
  Top 0.254: U2.9 63.23,25.14 63.87,25.77 R11.1
R2
  Top 0.254: U1.9 31.42,24.46 32.88,23 R16.1
R3
  Top 0.254: U5.9 24.37,34.55 24.89,34.04 R17.1
R4
  Top 0.254: R18.1 23.62,55 23.62,56.39 23.19,56.82 U4.9
S1A
  Top 1.016: D17.A 10.17,66.81 D13.C 8.38,66.8 6.35,64.77 J4.5
  pour Top (rank 2): 17.53,60.71 17.53,60.45 16.26,60.45 15.49,61.21 15.49,65.79 14.99,66.29 12.7,66.29 12.7,67.31 15.24,67.31 16.26,66.29 16.26,61.21 16.76,60.71
S1B
  Top 1.016: D16.A 10.17,61.23 D12.C 8.63,61.21 7.33,59.91 J4.4
  pour Top (rank 3): 12.7,61.72 12.7,60.71 14.22,60.71 14.99,59.94 17.53,59.94 17.53,60.2 16,60.2 14.48,61.72
S1C
  Top 1.016: D15.A 10.17,55.64 D11.C 7.87,57.91 J4.3
  pour Top (rank 3): 12.7,56.13 12.7,55.12 14.22,55.12 14.73,55.63 14.73,57.15 16.26,58.67 17.27,58.67 17.27,58.93 15.49,58.93 13.72,57.15 13.72,56.39 13.46,56.13
S1D
  Top 1.016: D14.A 10.17,50.05 D10.C 8.13,52.07 8.13,54.86 7.08,55.91 J4.2
  pour Top (rank 2): 17.78,58.17 17.78,57.91 16.76,57.91 16.26,57.4 16.26,50.55 15.24,49.53 12.7,49.53 12.7,50.55 14.73,50.55 15.24,51.05 15.24,57.15 16.26,58.17
S2A
  Top 1.016: D33.A 10.17,44.21 D29.C 8.38,44.19 6.35,42.16 J5.5
  pour Top (rank 2): 17.53,37.85 17.53,37.59 16.26,37.59 15.49,38.35 15.49,43.18 14.99,43.69 12.7,43.69 12.7,44.7 15.24,44.7 16.26,43.69 16.26,38.35 16.76,37.85
S2B
  Top 1.016: D32.A 10.17,38.62 | 10.17,38.62 D28.C | J5.4 7.33,37.31 8.65,38.62 10.17,38.62
  pour Top (rank 3): 12.7,39.12 12.7,38.1 13.97,38.1 14.99,37.08 17.53,37.08 17.53,37.34 16,37.34 14.22,39.12
S2C
  Top 1.016: D31.A 12.69,33.02 D27.C 7.87,35.31 J5.3
  pour Top (rank 3): 12.7,33.53 12.7,32.51 14.22,32.51 14.73,33.02 14.73,34.29 16.26,35.81 17.27,35.81 17.27,36.07 15.49,36.07 13.72,34.29 13.72,33.53
S2D
  Top 1.016: D30.A 10.17,27.44 D18.C 8.13,29.46 8.13,32.26 7.08,33.31 J5.2
  pour Top (rank 2): 17.78,35.31 17.78,35.05 16.76,35.05 16.26,34.54 16.26,27.94 15.24,26.92 12.7,26.92 12.7,27.94 14.73,27.94 15.24,28.45 15.24,34.29 16.26,35.31
SCK  (via drill 0.35)
  Top 0.254: U1.13 27.61,27.87 27.94,28.19 v43.69,28.19 59.69,28.19 60.63,27.25 U2.13 | v35.05,59.94 34.98,60.02 U4.13 | v36.83,37.08 36.76,37.16 U5.13
  Bottom 0.254: v43.69,28.19 43.69,30.23 v36.83,37.08 35.05,38.86 v35.05,59.94 35.05,68.46 40.64,74.04 U$1.P$45
SW1
  pour Top (isolate 0.254, rank 3): 72.9,57.4 72.9,56.13 71.12,56.13 70.87,56.39 70.87,57.66 70.1,57.66 69.6,57.15 63.5,57.15 63.5,54.36 64.01,53.85 71.37,53.85 73.15,55.63 73.15,57.4
SW2
  pour Top (isolate 0.254, rank 3): 46.74,57.4 46.74,56.13 44.96,56.13 44.96,57.66 43.94,57.66 43.43,57.15 37.34,57.15 37.34,54.36 37.85,53.85 45.21,53.85 46.99,55.63 46.99,57.4
VALVE1
  Top 1.016: J2.1 15.12,5.2 D4.C D26.A
  pour Top (rank 2): 14.73,11.94 14.73,15.49 16.26,17.02 25.91,17.02 26.92,18.03 26.92,19.05 27.18,19.05 27.18,17.53 25.65,16 16.76,16 15.49,14.73 15.49,11.94
VALVE2
  Top 1.016: J2.3 D3.C D25.A
  pour Top: 27.3,19.05 27.3,16.89 25.91,15.49 22.35,15.49 21.84,14.99 21.84,11.94 22.61,11.94 22.61,13.97 23.11,14.48 26.42,14.48 27.69,15.75 27.69,19.05
VALVE3
  Top 1.016: J2.5 29.09,5.23 D2.C D24.A
  pour Top: 28.7,19.05 28.7,11.94 29.46,11.94 29.46,16.51 29.21,16.76 29.21,19.05
VALVE4
  Top 1.016: J2.7 36.2,5.12 D1.C D23.A
  pour Top (rank 2): 29.46,19.05 29.46,17.27 30.73,16 34.8,16 35.81,14.99 35.81,11.94 36.58,11.94 36.58,15.75 35.31,17.02 30.48,17.02 29.72,17.78 29.72,19.05
VALVE5
  Top 1.016: J1.1 48.14,5.2 D8.C D22.A
  pour Top (rank 2): 47.75,11.94 47.75,15.49 49.28,17.02 58.93,17.02 59.94,18.03 59.94,19.05 60.2,19.05 60.2,17.53 58.67,16 49.78,16 48.51,14.73 48.51,11.94
VALVE6
  Top 1.016: J1.3 D7.C D21.A
  pour Top: 60.33,19.05 60.33,16.89 58.93,15.49 55.37,15.49 54.86,14.99 54.86,11.94 55.63,11.94 55.63,13.97 56.13,14.48 59.44,14.48 60.71,15.75 60.71,19.05
VALVE7
  Top 1.016: J1.5 62.11,5.23 D6.C D20.A
  pour Top: 61.72,19.05 61.72,11.94 62.48,11.94 62.48,16.51 62.23,16.76 62.23,19.05
VALVE8
  Top 1.016: J1.7 69.22,5.12 D5.C D19.A
  pour Top (rank 2): 62.48,19.05 62.48,17.27 63.75,16 67.82,16 68.83,14.99 68.83,11.94 69.6,11.94 69.6,15.75 68.33,17.02 63.5,17.02 62.74,17.78 62.74,19.05
VEN1
  Top 0.254: R4.2 R3.1 74.03,58.3 72.9,59.44 U3.5
VEN2
  Top 0.254: R14.2 R13.1 48.12,58.3 46.99,59.44 U6.5